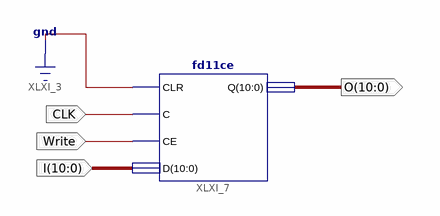
[diagram p0: schematic sheet 1]
// Xilinx ISE schematic reg11.sch (spartan3e) as structural Verilog: 1 symbols, 4 ports
module reg11 (
  input  [10:0] I,
  input  Write,
  input  CLK,
  output [10:0] O
);

  fd11ce XLXI_7 (.CLR(1'b0), .C(CLK), .CE(Write), .D(I), .Q(O));
endmodule
